# Altium schematic sheet Sheet1.SchDoc
size A4
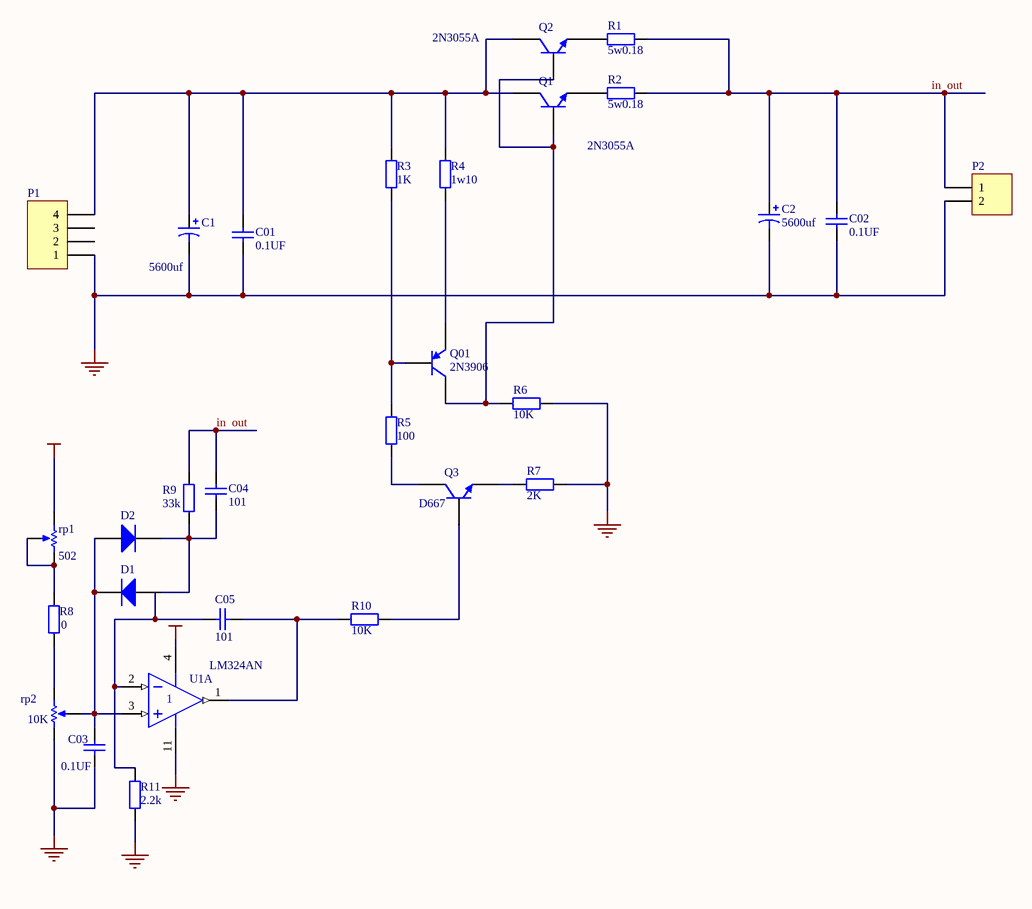
[diagram p0: Sheet1.SchDoc]

## Parts
C1  value 5600uf  [RB7.6-15]  (hidden comment: Cap Pol1)
C01  value 0.1UF  [RAD-0.3]  (hidden comment: Cap)
C2  value 5600uf  [RB7.6-15]  (hidden comment: Cap Pol1)
C02  value 0.1UF  [RAD-0.3]  (hidden comment: Cap)
C03  value 0.1UF  [RAD-0.3]  (hidden comment: Cap)
C04  value 101  [RAD-0.3]  (hidden comment: Cap)
C05  value 101  [RAD-0.3]  (hidden comment: Cap)
D1  Diode 1N4148  [DIO7.1-3.9x1.9]  (value not drawn)
D2  Diode 1N4148  [DIO7.1-3.9x1.9]  (value not drawn)
P1  Header 4  [HDR1X4]  (value not drawn)
P2  Header 2  [HDR1X2]  (value not drawn)
Q01  2N3906  [BCY-W3/E4]
Q1  2N3055A  [1-04]
Q2  2N3055A  [1-04]
Q3  D667  [BCY-W3/E4]
R1  value 5w0.18  [AXIAL-0.4]  (hidden comment: Res2)
R2  value 5w0.18  [AXIAL-0.4]  (hidden comment: Res2)
R3  value 1K  [AXIAL-0.4]  (hidden comment: Res2)
R4  value 1w10  [AXIAL-0.4]  (hidden comment: Res2)
R5  value 100  [AXIAL-0.4]  (hidden comment: Res2)
R6  value 10K  [AXIAL-0.4]  (hidden comment: Res2)
R7  value 2K  [AXIAL-0.4]  (hidden comment: Res2)
R8  0  [AXIAL-0.4]
R9  value 33k  [AXIAL-0.4]  (hidden comment: Res2)
R10  value 10K  [AXIAL-0.4]  (hidden comment: Res2)
R11  value 2.2k  [AXIAL-0.4]  (hidden comment: Res2)
rp1  value 502  [VR5]  (hidden comment: RPot)
rp2  value 10K  [VR5]  (hidden comment: RPot)
U1  LM324AN  [646-06]  (part A of 4)

## Nets
2.5V: rp1.1(TOP)
12V: U1.4(V+)
GND: C01.1 C1.2 C02.1 C2.2 C03.2 P1.1 P2.2 R6.2 R7.1 R11.2 rp2.1(TOP) U1.11(V-)
in  out: C2.1 C02.2 C04.1 P2.1 R1.2 R2.2 R9.1
NetC1_1: C1.1 C01.2 P1.4 Q1.3(C) Q2.3(C) R3.2 R4.2
NetC03_1: C03.1 D1.2(K) D2.1(A) rp2.3(TAP) U1.3(IN+)
NetC04_2: C04.2 D1.1(A) D2.2(K) R9.2
NetC05_1: C05.1 R11.1 U1.2(IN-)
NetC05_2: C05.2 R10.1 U1.1(OUT)
NetQ1_1: Q1.1(B) Q01.3(C) Q2.1(B) R6.1
NetQ01_1: Q01.1(E) R4.1
NetQ01_2: Q01.2(B) R3.1 R5.2
NetQ1_2: Q1.2(E) R2.1
NetQ2_2: Q2.2(E) R1.1
NetQ3_1: Q3.1(E) R7.2
NetQ3_2: Q3.2(B) R10.2
NetQ3_3: Q3.3(C) R5.1
NetR8_1: R8.1 rp1.2(BOT) rp1.3(TAP)
NetR8_2: R8.2 rp2.2(BOT)

Not connected (* = marked no-connect by the designer): P1 2 3

## Library data of the parts
C1 C2 = Cap Pol1: Polarized Capacitor (Radial); Published: 8-Jun-2000; LatestRevisionDate: 17-Jul-2002; LatestRevisionNote: Re-released for DXP Platform.; Publisher: Altium Limited
C01 C02 C03 C04 C05 = Cap: Capacitor; Published: 8-Jun-2000; LatestRevisionDate: 17-Jul-2002; LatestRevisionNote: Re-released for DXP Platform.; Publisher: Altium Limited
D1 D2 = Diode 1N4148: High Conductance Fast Diode; Published: 8-Jun-2000; LatestRevisionDate: 17-Jul-2002; LatestRevisionNote: Re-released for DXP Platform.; DatasheetDocument: 1997; PackageReference: DO-35; Publisher: Altium Limited; Code_JEDEC: DO-204-AH
P1 = Header 4: Header, 4-Pin; LatestRevisionDate: 17-Jul-2002; LatestRevisionNote: Re-released for DXP Platform.; Publisher: Altium Limited
P2 = Header 2: Header, 2-Pin; LatestRevisionDate: 17-Jul-2002; LatestRevisionNote: Re-released for DXP Platform.; Publisher: Altium Limited
Q01 = 2N3906: PNP General Purpose Amplifier; Published: 8-Jun-2000; LatestRevisionDate: 15-Jan-2003; LatestRevisionNote: PCB Footprint 'BCY-W3/D4.7' replaced; DatasheetDocument: 1997; PackageReference: TO-92A; Publisher: Altium Limited; Code_JEDEC: TO-92A
Q1 Q2 = 2N3055A: Complementary Silicon High-Power NPN Transistor, 15 Amp, 60 Volts and 115 Watts; Published: 19-Mar-2004; DatasheetDocument: 1984; PackageDocument: Rev.3, 1984; PackageReference: 1-04; Publisher: Altium Limited; Code_JEDEC: TO-204 AA
Q3 = 2N3904: NPN General Purpose Amplifier; Published: 8-Jun-2000; LatestRevisionDate: 15-Jan-2003; LatestRevisionNote: PCB Footprint 'BCY-W3/D4.7' replaced; DatasheetDocument: 1997; PackageReference: TO-92A; Publisher: Altium Limited; Code_JEDEC: TO-92A
R1-R7 R9-R11 = Res2: Resistor; Published: 8-Jun-2000; LatestRevisionDate: 17-Jul-2002; LatestRevisionNote: Re-released for DXP Platform.; Publisher: Altium Limited
R8 = Res2: Resistor; 0: 1K; Published: 8-Jun-2000; LatestRevisionDate: 17-Jul-2002; LatestRevisionNote: Re-released for DXP Platform.; Publisher: Altium Limited
rp1 rp2 = RPot: Potentiometer; Sim Note: Enter the Resistance value and the set point into parameter fields.; Set Position: 0.5; Published: 8-Jun-2000; LatestRevisionDate: 17-Jul-2002; LatestRevisionNote: Re-released for DXP Platform.; Publisher: Altium Limited
U1 = LM324AN: Quad Low-Power Operational Amplifier; PackageDocument: 1997; Published: 17-Jul-2002; DatasheetDocument: 1988; PackageReference: 646-06; Publisher: Altium Limited